# Altium schematic sheet TopSheet.SchDoc: UltraZohm ADC
size A4; Author: Thomas Kreppel; CompanyName: TU München; DrawnBy: Thomas Kreppel; Engineer: Eyke Liegmann; Organization: TUM EAL; Address1: Arcisstraße 21; Address2: 80333 München; Address3: GERMANY; SheetNumber: 1; SheetTotal: 6; CompanyName2: EAL
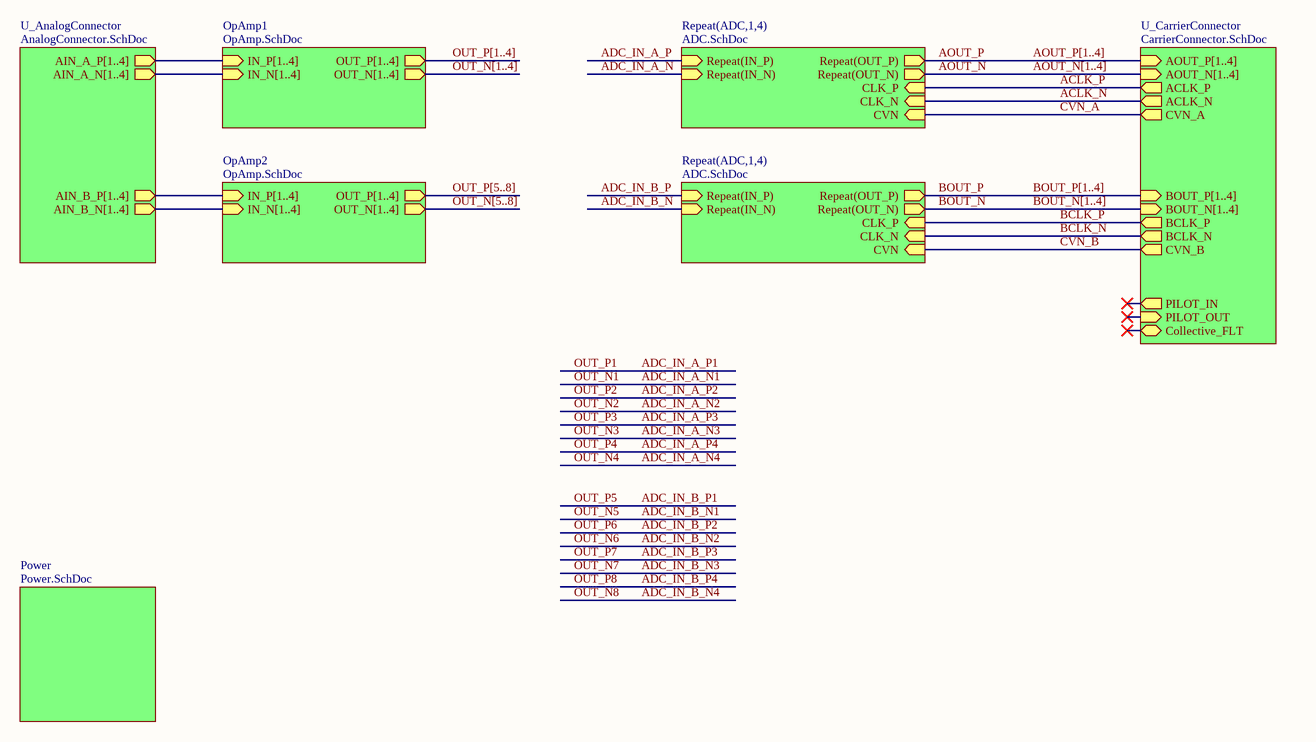
[diagram p0: TopSheet.SchDoc]

## Sub-sheets
OpAmp1 = OpAmp.SchDoc: OUT_N[1..4] (out), OUT_P[1..4] (out), IN_N[1..4] (in), IN_P[1..4] (in)
OpAmp2 = OpAmp.SchDoc: IN_P[1..4] (in), IN_N[1..4] (in), OUT_P[1..4] (out), OUT_N[1..4] (out)
Power = Power.SchDoc: no entries
Repeat(ADC,1,4) = ADC.SchDoc: CVN (in), Repeat(OUT_N) (out), Repeat(OUT_P) (out), Repeat(IN_N) (in), CLK_P (in), CLK_N (in), Repeat(IN_P) (in)
Repeat(ADC,1,4) = ADC.SchDoc: Repeat(OUT_N) (out), Repeat(IN_P) (in), CLK_P (in), Repeat(OUT_P) (out), CVN (in), CLK_N (in), Repeat(IN_N) (in)
U_AnalogConnector = AnalogConnector.SchDoc: AIN_B_P[1..4] (out), AIN_B_N[1..4] (out), AIN_A_N[1..4] (out), AIN_A_P[1..4] (out)
U_CarrierConnector = CarrierConnector.SchDoc: PILOT_OUT (in), PILOT_IN (out), Collective_FLT (bidir), BCLK_N (out), ACLK_P (out), BCLK_P (out), ACLK_N (out), BOUT_P[1..4] (in), BOUT_N[1..4] (in), AOUT_P[1..4] (in), AOUT_N[1..4] (in), CVN_B (out), CVN_A (out)

## Nets
ACLK_N: sheet U_CarrierConnector/ACLK_N, sheet Repeat(ADC,1,4)/CLK_N
ACLK_P: sheet U_CarrierConnector/ACLK_P, sheet Repeat(ADC,1,4)/CLK_P
ADC_IN_A_N: sheet Repeat(ADC,1,4)/Repeat(IN_N)
ADC_IN_A_P: sheet Repeat(ADC,1,4)/Repeat(IN_P)
ADC_IN_B_N: sheet Repeat(ADC,1,4)/Repeat(IN_N)
ADC_IN_B_P: sheet Repeat(ADC,1,4)/Repeat(IN_P)
AOUT_N: sheet Repeat(ADC,1,4)/Repeat(OUT_N)
AOUT_P: sheet Repeat(ADC,1,4)/Repeat(OUT_P)
BCLK_N: sheet U_CarrierConnector/BCLK_N, sheet Repeat(ADC,1,4)/CLK_N
BCLK_P: sheet U_CarrierConnector/BCLK_P, sheet Repeat(ADC,1,4)/CLK_P
BOUT_N: sheet Repeat(ADC,1,4)/Repeat(OUT_N)
BOUT_P: sheet Repeat(ADC,1,4)/Repeat(OUT_P)
CVN_A: sheet U_CarrierConnector/CVN_A, sheet Repeat(ADC,1,4)/CVN
CVN_B: sheet U_CarrierConnector/CVN_B, sheet Repeat(ADC,1,4)/CVN

## Buses and harness runs
bus AOUT_N[1..4] = sheet U_CarrierConnector/AOUT_N[1..4]
bus AOUT_P[1..4] = sheet U_CarrierConnector/AOUT_P[1..4]
bus BOUT_N[1..4] = sheet U_CarrierConnector/BOUT_N[1..4]
bus BOUT_P[1..4] = sheet U_CarrierConnector/BOUT_P[1..4]
bus OUT_N[1..4] = sheet OpAmp1/OUT_N[1..4]
bus OUT_N[5..8] = sheet OpAmp2/OUT_N[1..4]
bus OUT_P[1..4] = sheet OpAmp1/OUT_P[1..4]
bus OUT_P[5..8] = sheet OpAmp2/OUT_P[1..4]
bus sheet OpAmp1/IN_N[1..4] = sheet U_AnalogConnector/AIN_A_N[1..4]
bus sheet OpAmp1/IN_P[1..4] = sheet U_AnalogConnector/AIN_A_P[1..4]
bus sheet OpAmp2/IN_N[1..4] = sheet U_AnalogConnector/AIN_B_N[1..4]
bus sheet OpAmp2/IN_P[1..4] = sheet U_AnalogConnector/AIN_B_P[1..4]

## Notes on the sheet
- Title
- Size:
- Date:
- A4
- Revision:
- Time:
- Sheet
- of
- Author:
- Project: